# Altium schematic sheet 05_RTL8211F.SchDoc
size 386 x 246 mm; Page Create Date: March  8, 1995; Page Number: 6; Page Size: B; Page Count: 8; DsnPath: C:\Users\Administrator\Desktop\123\KARGOBOT-TCU-ORIN-V1.1.DSN; SchematicName: KARGOBT-TCU-ORIN-V1.1; PageName: P6_RTL8211F/D; PageSize: B; TopSchematic: True
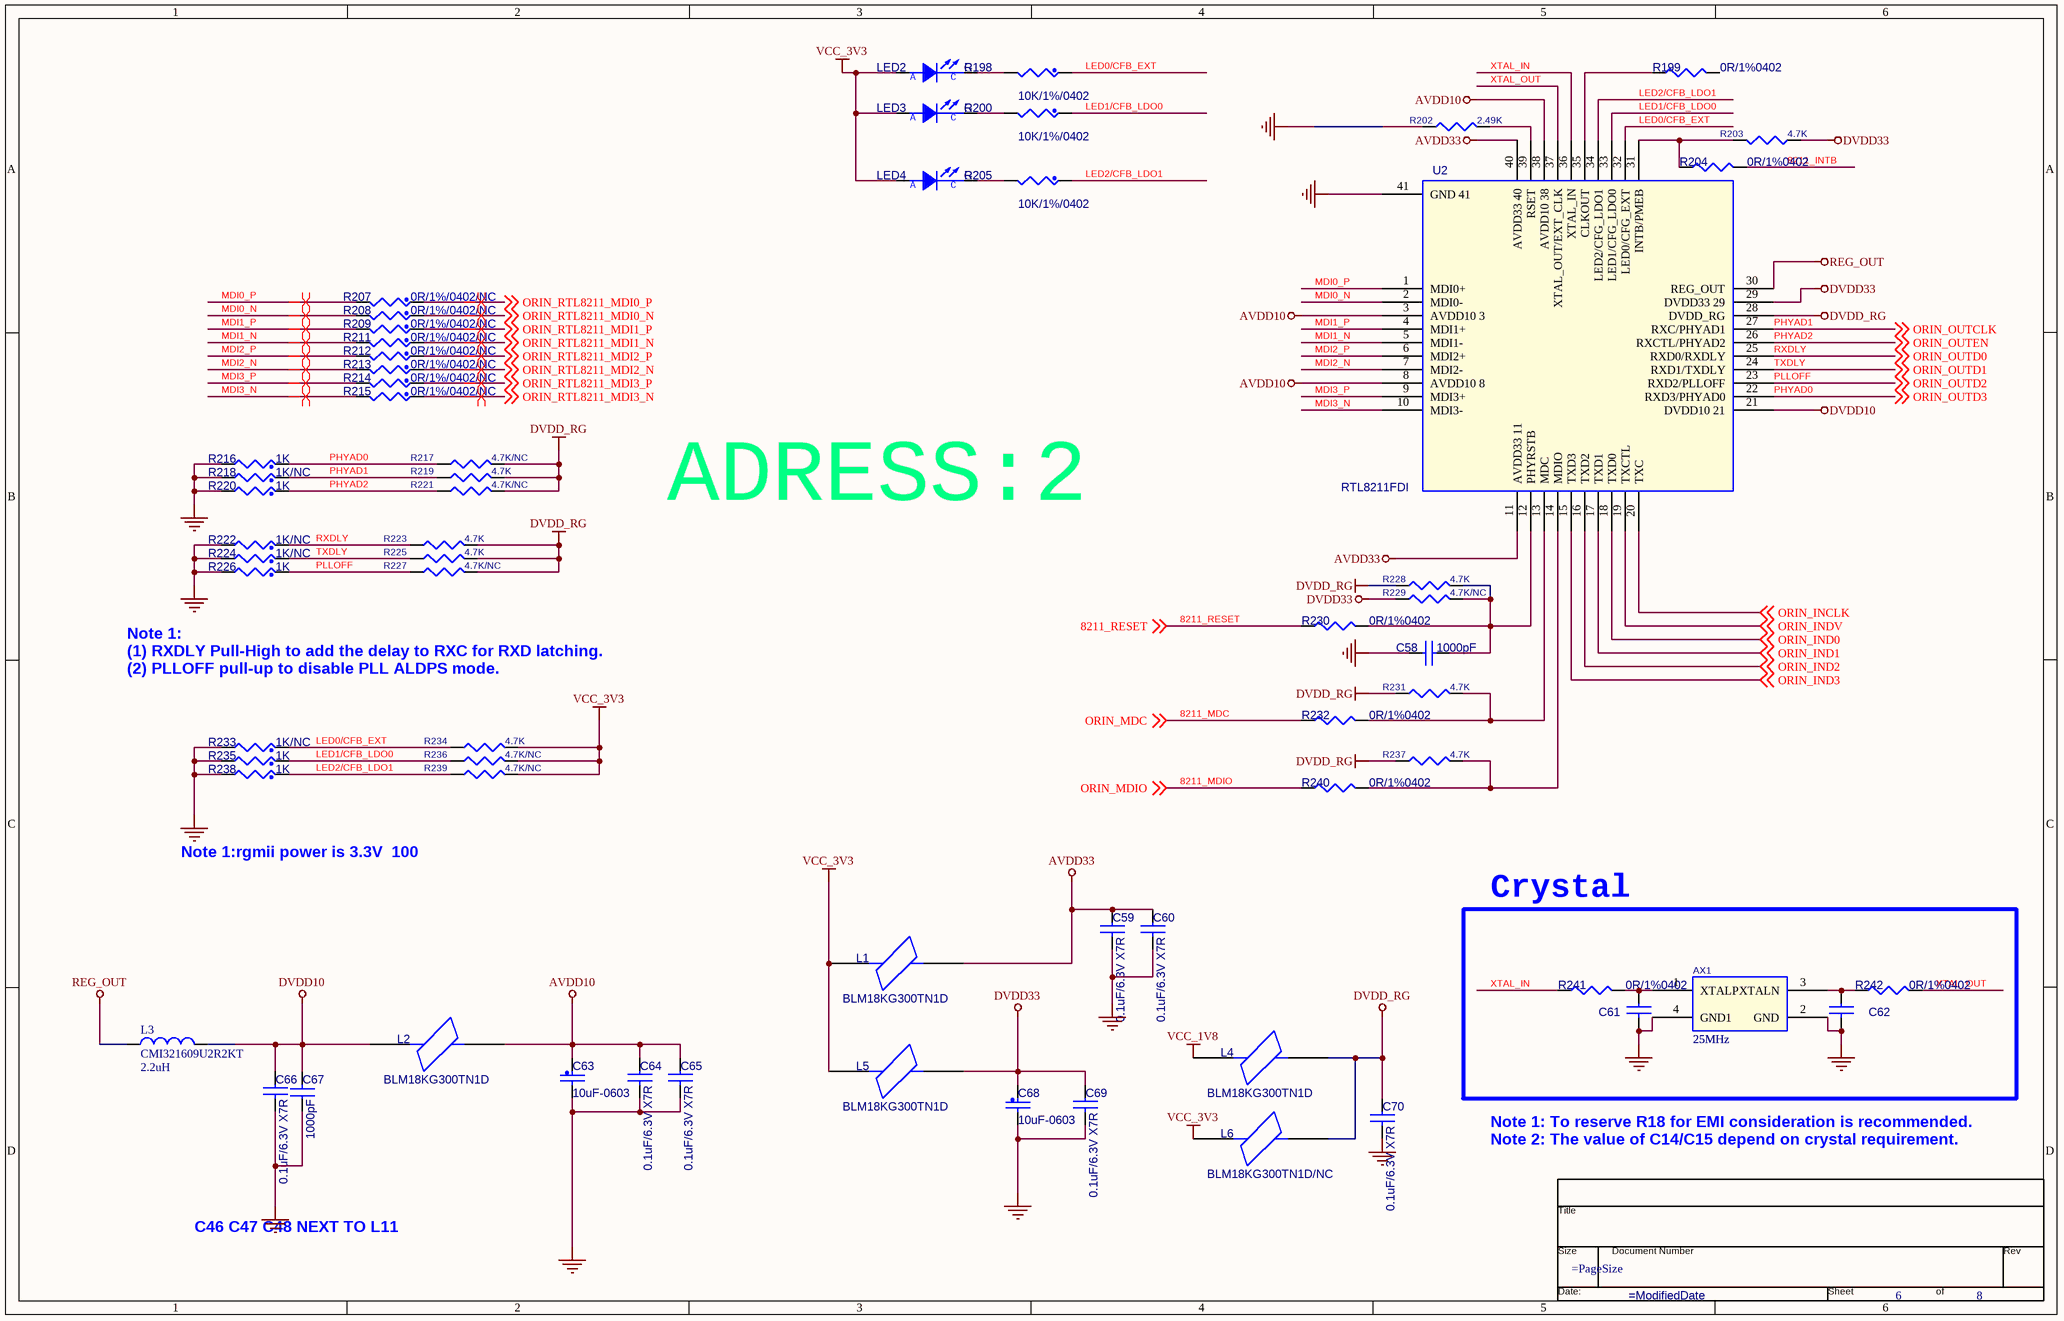
[diagram p0: 05_RTL8211F.SchDoc]

## Parts
*  Page Number: 6  Page Count: 8  (graphical)
AX1  25MHz  [2016]
C58  value 1000pF  [C0402]  (hidden comment: CAP NP_Dup4)
C59  value 0.1uF/6.3V X7R  [C0402]  (hidden comment: CAP NP_Dup4)
C60  value 0.1uF/6.3V X7R  [C0402]  (hidden comment: CAP NP_Dup4)
C61  CAP NP_Dup3  [C0402]  (value not drawn)
C62  CAP NP_Dup3  [C0402]  (value not drawn)
C63  value 10uF-0603  [C0603]  (hidden comment: CAP_NP)
C64  value 0.1uF/6.3V X7R  [C0402]  (hidden comment: CAP NP_Dup4)
C65  value 0.1uF/6.3V X7R  [C0402]  (hidden comment: CAP NP_Dup4)
C66  value 0.1uF/6.3V X7R  [C0402]  (hidden comment: CAP NP_Dup4)
C67  value 1000pF  [C0402]  (hidden comment: CAP NP_Dup4)
C68  value 10uF-0603  [C0603]  (hidden comment: CAP_NP)
C69  value 0.1uF/6.3V X7R  [C0402]  (hidden comment: CAP NP_Dup4)
C70  value 0.1uF/6.3V X7R  [C0402]  (hidden comment: CAP NP_Dup4)
L1  value BLM18KG300TN1D  [L0603]  (hidden comment: BEAD)
L2  value BLM18KG300TN1D  [L0603]  (hidden comment: BEAD)
L3  CMI321609U2R2KT  value 2.2uH  [L1206]
L4  value BLM18KG300TN1D  [L0603]  (hidden comment: BEAD)
L5  value BLM18KG300TN1D  [L0603]  (hidden comment: BEAD)
L6  value BLM18KG300TN1D/NC  [L0603]  (hidden comment: BEAD)
LED2  Value1: G  [LED0603]  (hidden comment: LED_P2_Dup1)
LED3  Value1: G  [LED0603]  (hidden comment: LED_P2_Dup1)
LED4  Value1: G  [LED0603]  (hidden comment: LED_P2_Dup1)
R198  value 10K/1%/0402  [R0402]  (hidden comment: RES_Dup2)
R199  value 0R/1%0402  [R0402]  (hidden comment: R_Dup3)
R200  value 10K/1%/0402  [R0402]  (hidden comment: RES_Dup2)
R202  value 2.49K  [R0402]  (hidden comment: RESISTOR)
R203  value 4.7K  [R0402]  (hidden comment: RESISTOR)
R204  value 0R/1%0402  [R0402]  (hidden comment: R_Dup3)
R205  value 10K/1%/0402  [R0402]  (hidden comment: RES_Dup2)
R207  value 0R/1%/0402/NC  [R0402]  (hidden comment: RES_Dup2)
R208  value 0R/1%/0402/NC  [R0402]  (hidden comment: RES_Dup2)
R209  value 0R/1%/0402/NC  [R0402]  (hidden comment: RES_Dup2)
R211  value 0R/1%/0402/NC  [R0402]  (hidden comment: RES_Dup2)
R212  value 0R/1%/0402/NC  [R0402]  (hidden comment: RES_Dup2)
R213  value 0R/1%/0402/NC  [R0402]  (hidden comment: RES_Dup2)
R214  value 0R/1%/0402/NC  [R0402]  (hidden comment: RES_Dup2)
R215  value 0R/1%/0402/NC  [R0402]  (hidden comment: RES_Dup2)
R216  value 1K  [R0402]  (hidden comment: RES_Dup2)
R217  value 4.7K/NC  [R0402]  (hidden comment: RESISTOR)
R218  value 1K/NC  [R0402]  (hidden comment: RES_Dup2)
R219  value 4.7K  [R0402]  (hidden comment: RESISTOR)
R220  value 1K  [R0402]  (hidden comment: RES_Dup2)
R221  value 4.7K/NC  [R0402]  (hidden comment: RESISTOR)
R222  value 1K/NC  [R0402]  (hidden comment: RES_Dup2)
R223  value 4.7K  [R0402]  (hidden comment: RESISTOR)
R224  value 1K/NC  [R0402]  (hidden comment: RES_Dup2)
R225  value 4.7K  [R0402]  (hidden comment: RESISTOR)
R226  value 1K  [R0402]  (hidden comment: RES_Dup2)
R227  value 4.7K/NC  [R0402]  (hidden comment: RESISTOR)
R228  value 4.7K  [R0402]  (hidden comment: RESISTOR)
R229  value 4.7K/NC  [R0402]  (hidden comment: RESISTOR)
R230  value 0R/1%0402  [R0402]  (hidden comment: R_Dup3)
R231  value 4.7K  [R0402]  (hidden comment: RESISTOR)
R232  value 0R/1%0402  [R0402]  (hidden comment: R_Dup3)
R233  value 1K/NC  [R0402]  (hidden comment: RES_Dup2)
R234  value 4.7K  [R0402]  (hidden comment: RESISTOR)
R235  value 1K  [R0402]  (hidden comment: RES_Dup2)
R236  value 4.7K/NC  [R0402]  (hidden comment: RESISTOR)
R237  value 4.7K  [R0402]  (hidden comment: RESISTOR)
R238  value 1K  [R0402]  (hidden comment: RES_Dup2)
R239  value 4.7K/NC  [R0402]  (hidden comment: RESISTOR)
R240  value 0R/1%0402  [R0402]  (hidden comment: R_Dup3)
R241  value 0R/1%0402  [R0402]  (hidden comment: R_Dup3)
R242  value 0R/1%0402  [R0402]  (hidden comment: R_Dup3)
U2  value RTL8211FDI  [RTL8211]  (hidden comment: TL8211FDI)

## Blocks framed on the sheet
Crystal: AX1 C61 C62 R241 R242

## Nets
AVDD10: C63.1 C64.1 C65.1 L2.2 U2.3(AVDD10_3) U2.8(AVDD10_8) U2.38(AVDD10_38)
AVDD33: C59.1 C60.1 L1.2 U2.11(AVDD33_11) U2.40(AVDD33_40)
DVDD10: C66.1 C67.2 L2.1 L3.2 U2.21(DVDD10_21)
DVDD33: C68.1 C69.1 L5.2 R203.1 R229.1 U2.29(DVDD33_29)
DVDD_RG: C70.1 L4.2 L6.2 R217.2 R219.2 R221.2 R223.2 R225.2 R227.2 R228.1 R231.1 R237.1 U2.28(DVDD_RG)
GND: AX1.2(GND) AX1.4(GND1) C58.1 C59.2 C60.2 C61.2 C62.2 C63.2 C64.2 C65.2 C66.2 C67.1 C68.2 C69.2 C70.2 R202.1 R216.2 R218.2 R220.2 R222.2 R224.2 R226.2 R233.2 R235.2 R238.2 U2.41(GND_41)
REG_OUT: L3.1 U2.30(REG_OUT)
VCC_1V8: L4.1
VCC_3V3: L1.1 L5.1 L6.1 LED2.1(ANODE) LED3.1(ANODE) LED4.1(ANODE) R234.2 R236.2 R239.2
8211_INTB: R204.2
8211_MDC: R232.1 ; off-sheet ORIN_MDC  [also labelled ORIN_MDC]
8211_MDIO: R240.1 ; off-sheet ORIN_MDIO  [also labelled ORIN_MDIO]
8211_RESET: R230.1 ; off-sheet 8211_RESET
LED0/CFB_EXT: R198.1 R233.1 R234.1 U2.32(LED0/CFG_EXT)
LED1/CFB_LDO0: R200.1 R235.1 R236.1 U2.33(LED1/CFG_LDO0)
LED2/CFB_LDO1: R205.1 R238.1 R239.1 U2.34(LED2/CFG_LDO1)
MDI0_N: R208.2 U2.2(MDI0-)
MDI0_P: R207.2 U2.1(MDI0+)
MDI1_N: R211.2 U2.5(MDI1-)
MDI1_P: R209.2 U2.4(MDI1+)
MDI2_N: R213.2 U2.7(MDI2-)
MDI2_P: R212.2 U2.6(MDI2+)
MDI3_N: R215.2 U2.10(MDI3-)
MDI3_P: R214.2 U2.9(MDI3+)
ORIN_INCLK: U2.20(TXC) ; off-sheet ORIN_INCLK
ORIN_IND0: U2.18(TXD0) ; off-sheet ORIN_IND0
ORIN_IND1: U2.17(TXD1) ; off-sheet ORIN_IND1
ORIN_IND2: U2.16(TXD2) ; off-sheet ORIN_IND2
ORIN_IND3: U2.15(TXD3) ; off-sheet ORIN_IND3
ORIN_INDV: U2.19(TXCTL) ; off-sheet ORIN_INDV
ORIN_RTL8211_MDI0_N: R208.1 ; off-sheet ORIN_RTL8211_MDI0_N
ORIN_RTL8211_MDI0_P: R207.1 ; off-sheet ORIN_RTL8211_MDI0_P
ORIN_RTL8211_MDI1_N: R211.1 ; off-sheet ORIN_RTL8211_MDI1_N
ORIN_RTL8211_MDI1_P: R209.1 ; off-sheet ORIN_RTL8211_MDI1_P
ORIN_RTL8211_MDI2_N: R213.1 ; off-sheet ORIN_RTL8211_MDI2_N
ORIN_RTL8211_MDI2_P: R212.1 ; off-sheet ORIN_RTL8211_MDI2_P
ORIN_RTL8211_MDI3_N: R215.1 ; off-sheet ORIN_RTL8211_MDI3_N
ORIN_RTL8211_MDI3_P: R214.1 ; off-sheet ORIN_RTL8211_MDI3_P
PHYAD0: R216.1 R217.1 U2.22(RXD3/PHYAD0) ; off-sheet ORIN_OUTD3  [also labelled ORIN_OUTD3]
PHYAD1: R218.1 R219.1 U2.27(RXC/PHYAD1) ; off-sheet ORIN_OUTCLK  [also labelled ORIN_OUTCLK]
PHYAD2: R220.1 R221.1 U2.26(RXCTL/PHYAD2) ; off-sheet ORIN_OUTEN  [also labelled ORIN_OUTEN]
PLLOFF: R226.1 R227.1 U2.23(RXD2/PLLOFF) ; off-sheet ORIN_OUTD2  [also labelled ORIN_OUTD2]
RXDLY: R222.1 R223.1 U2.25(RXD0/RXDLY) ; off-sheet ORIN_OUTD0  [also labelled ORIN_OUTD0]
TXDLY: R224.1 R225.1 U2.24(RXD1/TXDLY) ; off-sheet ORIN_OUTD1  [also labelled ORIN_OUTD1]
XTAL_IN: R241.1 U2.36(XTAL_IN)
XTAL_OUT: R242.2 U2.37(XTAL_OUT/EXT_CLK)
NetAX1_1: AX1.1(XTALP) C61.1 R241.2
NetAX1_3: AX1.3(XTALN) C62.1 R242.1
NetC58_2: C58.2 R228.2 R229.2 R230.2 U2.12(PHYRSTB)
NetLED2_2: LED2.2(CATHODE) R198.2
NetLED3_2: LED3.2(CATHODE) R200.2
NetLED4_2: LED4.2(CATHODE) R205.2
NetR199_1: R199.1 U2.35(CLKOUT)
NetR202_2: R202.2 U2.39(RSET)
NetR203_2: R203.2 R204.1 U2.31(INTB/PMEB)
NetR231_2: R231.2 R232.2 U2.13(MDC)
NetR237_2: R237.2 R240.2 U2.14(MDIO)

Not connected (* = marked no-connect by the designer): R199 2

## Layout directives
differential pair: MDI0_N, MDI0_P, MDI1_N, MDI1_P, MDI2_N, MDI2_P, MDI3_N, MDI3_P, ORIN_RTL8211_MDI0_N, ORIN_RTL8211_MDI0_P, ORIN_RTL8211_MDI1_N, ORIN_RTL8211_MDI1_P, ORIN_RTL8211_MDI2_N, ORIN_RTL8211_MDI2_P, ORIN_RTL8211_MDI3_N, ORIN_RTL8211_MDI3_P

## Notes on the sheet
- ADRESS:2
- Note 1:
  (1) RXDLY Pull-High to add the delay to RXC for RXD latching.
  (2) PLLOFF pull-up to disable PLL ALDPS mode.
- Note 1:rgmii power is 3.3V  100
- (near *) Note 1: To reserve R18 for EMI consideration is recommended.
  Note 2: The value of C14/C15 depend on crystal requirement.
- C46 C47 C48 NEXT TO L11
- (in symbol LED_P2_Dup1) A; C
- (in symbol TitleBlock0) Title; Size; Document Number; Rev; Date:; Sheet; of

## Library data of the parts
* = TitleBlock0: Page Create Date: March  8, 1995; Page Size: =PageSize; Page Modify Date: =ModifiedDate
AX1 = XTAL_0: Part Reference: AX3; PCB Footprint: CRY5032; Value: 25MHz
C58 = CAP NP_Dup4: Part Reference: C68; PCB Footprint: C0402
C59 = CAP NP_Dup4: Part Reference: C69; PCB Footprint: C0402
C60 = CAP NP_Dup4: Part Reference: C70; PCB Footprint: C0402
C61 = CAP NP_Dup3: Part Reference: C71; Value: 20pF/50V X7R; PCB Footprint: C0402
C62 = CAP NP_Dup3: Part Reference: C72; Value: 20pF/50V X7R; PCB Footprint: C0402
C63 = CAP_NP: CAP CER 10UF 10V 10% X5R 0603; Part Reference: C75; CLASS: DISCRETE; AGILE_PN: 150-78675; MFG_NAME01: TDK; MFG_PN01: C1608X5R1A106K; CAD_APPROVED: Yes; Tolerance: 10%; TOL: 10%; ROHS: Yes; HEIGHT: 1.016MM; VOLTAGE: 10v; PCB Footprint: C0603
C64 = CAP NP_Dup4: Part Reference: C76; PCB Footprint: C0402
C65 = CAP NP_Dup4: Part Reference: C77; PCB Footprint: C0402
C66 = CAP NP_Dup4: Part Reference: C73; PCB Footprint: C0402
C67 = CAP NP_Dup4: Part Reference: C74; PCB Footprint: C0402
C68 = CAP_NP: CAP CER 10UF 10V 10% X5R 0603; Part Reference: C78; CLASS: DISCRETE; CAD_APPROVED: Yes; MFG_PN01: C1608X5R1A106K; MFG_NAME01: TDK; AGILE_PN: 150-78675; VOLTAGE: 10v; HEIGHT: 1.016MM; ROHS: Yes; TOL: 10%; Tolerance: 10%; PCB Footprint: C0603
C69 = CAP NP_Dup4: Part Reference: C79; PCB Footprint: C0402
C70 = CAP NP_Dup4: Part Reference: C80; PCB Footprint: C0402
L1 L4 = BEAD: Part Reference: L14; Value1: BLM18KG300TN1D; PCB Footprint: L0603
L2 = BEAD: Part Reference: L16; Value1: BLM18KG300TN1D; PCB Footprint: L0603
L3 = Inductor: Code_IEC: 1005; Published: 8-Jun-2000; LatestRevisionDate: 29-May-2009; LatestRevisionNote: IPC-7351 Footprint Added.; PackageReference: 0402-A; Publisher: Altium Limited; PackageDescription: Chip Inductor; Code_JEITA: 0402
L5 = BEAD: Part Reference: L17; Value1: BLM18KG300TN1D; PCB Footprint: L0603
L6 = BEAD: Part Reference: L14; Value1: BLM18KG300TN1D; PCB Footprint: L0603
LED2 = LED_P2_Dup1: 0603表贴LED-黄绿-高亮-25mA-1.75~2.35V; Part Reference: LED3; Part Number: 20.31.00.0001.02; Partsort: CGJ; partgrade: 工业级; 物料名称: 0603-LED-绿/ROHS; 规格型号: 亿光_19-213/G6C-BM1N2B/3T; 物料封装: 0603; 计量单位: 只; 厂家（直接生产厂家或品牌）: 亿光; 物料状态(样品、试用、在用、限用): 常规; 替代优先等级: 1; ESD等级: HBM 2KV; MSD等级: 2级; 描述项1: 黄绿; 描述项2: 无色; 描述项3: 高亮; 描述项4: 25mA; 样品库: 样品库：2-4; 采购周期（天）: 30; Priority: 优选; Life State: 发布; Unit: pcs; Erpitem: 外购; Part Type: 0603表贴LED; 供应商(代理商): 都城亿光; 描述项5: 1.75~2.35V; Mfr Part Number: 亿光_19-213/G6C-BM1N2B/3T; Version: A.0; Failure Rate: 16.926597; Pdm Number: 20.31.00.0001.02; Partname: 0603-LED-绿/RoHS; Partlifeflag: 1; PCB Footprint: LED0603
LED3 = LED_P2_Dup1: 0603表贴LED-黄绿-高亮-25mA-1.75~2.35V; Part Reference: LED4; Part Number: 20.31.00.0001.02; Partsort: CGJ; partgrade: 工业级; 物料名称: 0603-LED-绿/ROHS; 规格型号: 亿光_19-213/G6C-BM1N2B/3T; 物料封装: 0603; 计量单位: 只; 厂家（直接生产厂家或品牌）: 亿光; 物料状态(样品、试用、在用、限用): 常规; 替代优先等级: 1; ESD等级: HBM 2KV; MSD等级: 2级; 描述项1: 黄绿; 描述项2: 无色; 描述项3: 高亮; 描述项4: 25mA; 样品库: 样品库：2-4; 采购周期（天）: 30; Priority: 优选; Life State: 发布; Unit: pcs; Erpitem: 外购; Part Type: 0603表贴LED; 供应商(代理商): 都城亿光; 描述项5: 1.75~2.35V; Mfr Part Number: 亿光_19-213/G6C-BM1N2B/3T; Version: A.0; Failure Rate: 16.926597; Pdm Number: 20.31.00.0001.02; Partname: 0603-LED-绿/RoHS; Partlifeflag: 1; PCB Footprint: LED0603
LED4 = LED_P2_Dup1: 0603表贴LED-黄绿-高亮-25mA-1.75~2.35V; Part Reference: LED5; Part Number: 20.31.00.0001.02; Partsort: CGJ; partgrade: 工业级; 物料名称: 0603-LED-绿/ROHS; 规格型号: 亿光_19-213/G6C-BM1N2B/3T; 物料封装: 0603; 计量单位: 只; 厂家（直接生产厂家或品牌）: 亿光; 物料状态(样品、试用、在用、限用): 常规; 替代优先等级: 1; ESD等级: HBM 2KV; MSD等级: 2级; 描述项1: 黄绿; 描述项2: 无色; 描述项3: 高亮; 描述项4: 25mA; 样品库: 样品库：2-4; 采购周期（天）: 30; Priority: 优选; Life State: 发布; Unit: pcs; Erpitem: 外购; Part Type: 0603表贴LED; 供应商(代理商): 都城亿光; 描述项5: 1.75~2.35V; Mfr Part Number: 亿光_19-213/G6C-BM1N2B/3T; Version: A.0; Failure Rate: 16.926597; Pdm Number: 20.31.00.0001.02; Partname: 0603-LED-绿/RoHS; Partlifeflag: 1; PCB Footprint: LED0603
R198 = RES_Dup2: AC0402FR-0710KL/YAGEO; Part Reference: R84; CLASS: DISCRETE; PCB Footprint: R0402
R199 = R_Dup3: Part Reference: R85; PCB Footprint: R0402
R200 = RES_Dup2: AC0402FR-0710KL/YAGEO; Part Reference: R86; CLASS: DISCRETE; PCB Footprint: R0402
R202 = RESISTOR: Part Reference: R88; PCB Footprint: R0402
R203 = RESISTOR: Part Reference: R95; PCB Footprint: R0402
R204 = R_Dup3: Part Reference: R96; PCB Footprint: R0402
R205 = RES_Dup2: AC0402FR-0710KL/YAGEO; Part Reference: R90; CLASS: DISCRETE; PCB Footprint: R0402
R207 = RES_Dup2: AC0402FR-070RL/YAGEO; Part Reference: R97; CLASS: DISCRETE; SIGNAL_MODEL: DEFAULT_RESISTOR_33.000000OHM_2_1; FPLIST: RC0603_OV; CAD_APPROVED: Yes; MFG_PN01: CR-02FL6---33R; MFG_NAME01: YAGEO; Tolerance: 1%; AGILE_PN: 470-75790; TOL: 5%; ROHS: Yes; HEIGHT: 0.4MM; PCB Footprint: R0402
R208 = RES_Dup2: AC0402FR-070RL/YAGEO; Part Reference: R98; CLASS: DISCRETE; TOL: 5%; AGILE_PN: 470-75790; Tolerance: 1%; MFG_NAME01: YAGEO; MFG_PN01: CR-02FL6---33R; CAD_APPROVED: Yes; FPLIST: RC0603_OV; SIGNAL_MODEL: DEFAULT_RESISTOR_33.000000OHM_2_1; HEIGHT: 0.4MM; ROHS: Yes; PCB Footprint: R0402
R209 = RES_Dup2: AC0402FR-070RL/YAGEO; Part Reference: R99; CLASS: DISCRETE; TOL: 5%; AGILE_PN: 470-75790; Tolerance: 1%; MFG_NAME01: YAGEO; MFG_PN01: CR-02FL6---33R; CAD_APPROVED: Yes; FPLIST: RC0603_OV; SIGNAL_MODEL: DEFAULT_RESISTOR_33.000000OHM_2_1; HEIGHT: 0.4MM; ROHS: Yes; PCB Footprint: R0402
R211 = RES_Dup2: AC0402FR-070RL/YAGEO; Part Reference: R101; CLASS: DISCRETE; TOL: 5%; AGILE_PN: 470-75790; Tolerance: 1%; MFG_NAME01: YAGEO; MFG_PN01: CR-02FL6---33R; CAD_APPROVED: Yes; FPLIST: RC0603_OV; SIGNAL_MODEL: DEFAULT_RESISTOR_33.000000OHM_2_1; HEIGHT: 0.4MM; ROHS: Yes; PCB Footprint: R0402
R212 = RES_Dup2: AC0402FR-070RL/YAGEO; Part Reference: R102; CLASS: DISCRETE; TOL: 5%; AGILE_PN: 470-75790; Tolerance: 1%; MFG_NAME01: YAGEO; MFG_PN01: CR-02FL6---33R; CAD_APPROVED: Yes; FPLIST: RC0603_OV; SIGNAL_MODEL: DEFAULT_RESISTOR_33.000000OHM_2_1; HEIGHT: 0.4MM; ROHS: Yes; PCB Footprint: R0402
R213 = RES_Dup2: AC0402FR-070RL/YAGEO; Part Reference: R103; CLASS: DISCRETE; TOL: 5%; AGILE_PN: 470-75790; Tolerance: 1%; MFG_NAME01: YAGEO; MFG_PN01: CR-02FL6---33R; CAD_APPROVED: Yes; FPLIST: RC0603_OV; SIGNAL_MODEL: DEFAULT_RESISTOR_33.000000OHM_2_1; HEIGHT: 0.4MM; ROHS: Yes; PCB Footprint: R0402
R214 = RES_Dup2: AC0402FR-070RL/YAGEO; Part Reference: R104; CLASS: DISCRETE; TOL: 5%; AGILE_PN: 470-75790; Tolerance: 1%; MFG_NAME01: YAGEO; MFG_PN01: CR-02FL6---33R; CAD_APPROVED: Yes; FPLIST: RC0603_OV; SIGNAL_MODEL: DEFAULT_RESISTOR_33.000000OHM_2_1; HEIGHT: 0.4MM; ROHS: Yes; PCB Footprint: R0402
R215 = RES_Dup2: AC0402FR-070RL/YAGEO; Part Reference: R105; CLASS: DISCRETE; TOL: 5%; AGILE_PN: 470-75790; Tolerance: 1%; MFG_NAME01: YAGEO; MFG_PN01: CR-02FL6---33R; CAD_APPROVED: Yes; FPLIST: RC0603_OV; SIGNAL_MODEL: DEFAULT_RESISTOR_33.000000OHM_2_1; HEIGHT: 0.4MM; ROHS: Yes; PCB Footprint: R0402
R216 = RES_Dup2: RES MF 4.7K 1/16W 5% 0402; Part Reference: R106; CLASS: DISCRETE; AGILE_PN: 470-75626; MFG_NAME01: KOA SPEER; MFG_PN01: RK73B1ETTP472J; CAD_APPROVED: Yes; FPLIST: RC0402_25,RC0402_HD,RC0402_CC; HEIGHT: 0.41mm; TOL: 5%; Tolerance: 5%; ROHS: Yes; PCB Footprint: R0402
R217 = RESISTOR: Part Reference: R107; PCB Footprint: R0402
R218 = RES_Dup2: RES MF 4.7K 1/16W 5% 0402; Part Reference: R108; CLASS: DISCRETE; FPLIST: RC0402_25,RC0402_HD,RC0402_CC; CAD_APPROVED: Yes; MFG_PN01: RK73B1ETTP472J; MFG_NAME01: KOA SPEER; AGILE_PN: 470-75626; ROHS: Yes; Tolerance: 5%; TOL: 5%; HEIGHT: 0.41mm; PCB Footprint: R0402
R219 = RESISTOR: Part Reference: R109; PCB Footprint: R0402
R220 = RES_Dup2: RES MF 4.7K 1/16W 5% 0402; Part Reference: R110; CLASS: DISCRETE; FPLIST: RC0402_25,RC0402_HD,RC0402_CC; CAD_APPROVED: Yes; MFG_PN01: RK73B1ETTP472J; MFG_NAME01: KOA SPEER; AGILE_PN: 470-75626; ROHS: Yes; Tolerance: 5%; TOL: 5%; HEIGHT: 0.41mm; PCB Footprint: R0402
R221 = RESISTOR: Part Reference: R111; PCB Footprint: R0402
R222 = RES_Dup2: RES MF 4.7K 1/16W 5% 0402; Part Reference: R112; CLASS: DISCRETE; AGILE_PN: 470-75626; MFG_NAME01: KOA SPEER; MFG_PN01: RK73B1ETTP472J; CAD_APPROVED: Yes; FPLIST: RC0402_25,RC0402_HD,RC0402_CC; HEIGHT: 0.41mm; TOL: 5%; Tolerance: 5%; ROHS: Yes; PCB Footprint: R0402
R223 = RESISTOR: Part Reference: R113; PCB Footprint: R0402
R224 = RES_Dup2: RES MF 4.7K 1/16W 5% 0402; Part Reference: R114; CLASS: DISCRETE; AGILE_PN: 470-75626; MFG_NAME01: KOA SPEER; MFG_PN01: RK73B1ETTP472J; CAD_APPROVED: Yes; FPLIST: RC0402_25,RC0402_HD,RC0402_CC; HEIGHT: 0.41mm; TOL: 5%; Tolerance: 5%; ROHS: Yes; PCB Footprint: R0402
R225 = RESISTOR: Part Reference: R115; PCB Footprint: R0402
R226 = RES_Dup2: RES MF 4.7K 1/16W 5% 0402; Part Reference: R116; CLASS: DISCRETE; AGILE_PN: 470-75626; MFG_NAME01: KOA SPEER; MFG_PN01: RK73B1ETTP472J; CAD_APPROVED: Yes; FPLIST: RC0402_25,RC0402_HD,RC0402_CC; HEIGHT: 0.41mm; TOL: 5%; Tolerance: 5%; ROHS: Yes; PCB Footprint: R0402
R227 = RESISTOR: Part Reference: R117; PCB Footprint: R0402
R228 R231 = RESISTOR: Part Reference: R120; PCB Footprint: R0402
R229 = RESISTOR: Part Reference: R118; PCB Footprint: R0402
R230 = R_Dup3: Part Reference: R119; PCB Footprint: R0402
R232 = R_Dup3: Part Reference: R121; PCB Footprint: R0402
R233 = RES_Dup2: RES MF 4.7K 1/16W 5% 0402; Part Reference: R122; CLASS: DISCRETE; FPLIST: RC0402_25,RC0402_HD,RC0402_CC; CAD_APPROVED: Yes; MFG_PN01: RK73B1ETTP472J; MFG_NAME01: KOA SPEER; AGILE_PN: 470-75626; ROHS: Yes; Tolerance: 5%; TOL: 5%; HEIGHT: 0.41mm; PCB Footprint: R0402
R234 = RESISTOR: Part Reference: R123; PCB Footprint: R0402
R235 = RES_Dup2: RES MF 4.7K 1/16W 5% 0402; Part Reference: R124; CLASS: DISCRETE; AGILE_PN: 470-75626; MFG_NAME01: KOA SPEER; MFG_PN01: RK73B1ETTP472J; CAD_APPROVED: Yes; FPLIST: RC0402_25,RC0402_HD,RC0402_CC; HEIGHT: 0.41mm; TOL: 5%; Tolerance: 5%; ROHS: Yes; PCB Footprint: R0402
R236 = RESISTOR: Part Reference: R125; PCB Footprint: R0402
R237 = RESISTOR: Part Reference: R126; PCB Footprint: R0402
R238 = RES_Dup2: RES MF 4.7K 1/16W 5% 0402; Part Reference: R127; CLASS: DISCRETE; FPLIST: RC0402_25,RC0402_HD,RC0402_CC; CAD_APPROVED: Yes; MFG_PN01: RK73B1ETTP472J; MFG_NAME01: KOA SPEER; AGILE_PN: 470-75626; ROHS: Yes; Tolerance: 5%; TOL: 5%; HEIGHT: 0.41mm; PCB Footprint: R0402
R239 = RESISTOR: Part Reference: R128; PCB Footprint: R0402
R240 = R_Dup3: Part Reference: R129; PCB Footprint: R0402
R241 = R_Dup3: Part Reference: R130; PCB Footprint: R0402
R242 = R_Dup3: Part Reference: R131; PCB Footprint: R0402
U2 = TL8211FDI: Part Reference: U5; PCB Footprint: QFN40-RTL8211F